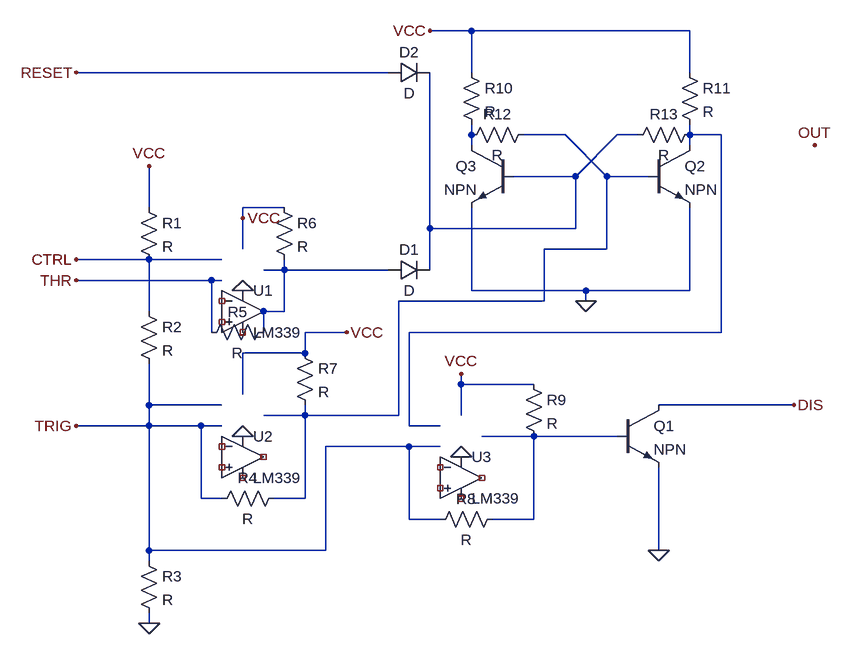
[diagram p0: schematic 555.asc]
555.asc, the LTspice schematic file:
Version 4
SHEET 1 1228 708
WIRE 624 -224 560 -224
WIRE 960 -224 624 -224
WIRE 496 -160 16 -160
WIRE 624 -160 624 -224
WIRE 960 -160 960 -224
WIRE 624 -64 624 -80
WIRE 768 -64 704 -64
WIRE 880 -64 848 -64
WIRE 960 -64 960 -80
WIRE 1008 -64 960 -64
WIRE 624 -48 624 -64
WIRE 960 -48 960 -64
WIRE 784 0 848 -64
WIRE 784 0 688 0
WIRE 832 0 768 -64
WIRE 896 0 832 0
WIRE 128 48 128 -16
WIRE 336 48 272 48
WIRE 272 64 272 48
WIRE 560 80 560 -160
WIRE 784 80 784 0
WIRE 784 80 560 80
WIRE 272 112 272 64
WIRE 832 112 832 0
WIRE 832 112 736 112
WIRE 128 128 16 128
WIRE 240 128 128 128
WIRE 336 144 336 128
WIRE 336 144 304 144
WIRE 496 144 336 144
WIRE 560 144 560 80
WIRE 224 160 16 160
WIRE 240 160 224 160
WIRE 624 176 624 48
WIRE 800 176 624 176
WIRE 960 176 960 48
WIRE 960 176 800 176
WIRE 736 192 736 112
WIRE 736 192 512 192
WIRE 800 192 800 176
WIRE 128 208 128 128
WIRE 336 208 336 144
WIRE 336 208 304 208
WIRE 224 240 224 160
WIRE 304 240 304 208
WIRE 432 240 368 240
WIRE 1008 240 1008 -64
WIRE 1008 240 528 240
WIRE 368 272 368 240
WIRE 368 272 272 272
WIRE 608 320 608 304
WIRE 720 320 608 320
WIRE 272 336 272 272
WIRE 128 352 128 288
WIRE 240 352 128 352
WIRE 1120 352 912 352
WIRE 368 368 368 352
WIRE 368 368 304 368
WIRE 512 368 512 192
WIRE 512 368 368 368
WIRE 608 368 608 320
WIRE 128 384 128 352
WIRE 128 384 16 384
WIRE 208 384 128 384
WIRE 240 384 208 384
WIRE 528 384 528 240
WIRE 576 384 528 384
WIRE 720 400 640 400
WIRE 848 400 720 400
WIRE 528 416 400 416
WIRE 576 416 528 416
WIRE 208 496 208 384
WIRE 240 496 208 496
WIRE 368 496 368 368
WIRE 368 496 320 496
WIRE 528 528 528 416
WIRE 576 528 528 528
WIRE 720 528 720 400
WIRE 720 528 656 528
WIRE 128 576 128 384
WIRE 400 576 400 416
WIRE 400 576 128 576
WIRE 912 576 912 448
WIRE 128 592 128 576
WIRE 128 688 128 672
FLAG 272 176 0
FLAG 272 400 0
FLAG 272 64 VCC
FLAG 432 240 VCC
FLAG 16 160 THR
FLAG 16 128 CTRL
FLAG 16 384 TRIG
FLAG 128 688 0
FLAG 128 -16 VCC
FLAG 16 -160 RESET
FLAG 608 432 0
FLAG 608 304 VCC
FLAG 912 576 0
FLAG 1120 352 DIS
FLAG 1152 -48 OUT
FLAG 800 192 0
FLAG 560 -224 VCC
SYMBOL res 112 32 R0
SYMATTR InstName R1
SYMBOL res 112 192 R0
SYMATTR InstName R2
SYMBOL res 112 576 R0
SYMATTR InstName R3
SYMBOL Comparators\\LM339 272 144 R0
SYMATTR InstName U1
SYMBOL Comparators\\LM339 272 368 R0
SYMATTR InstName U2
SYMBOL res 336 480 R90
WINDOW 0 0 56 VBottom 2
WINDOW 3 32 56 VTop 2
SYMATTR InstName R4
SYMBOL res 320 224 R90
WINDOW 0 0 56 VBottom 2
WINDOW 3 32 56 VTop 2
SYMATTR InstName R5
SYMBOL res 320 32 R0
SYMATTR InstName R6
SYMBOL res 352 256 R0
SYMATTR InstName R7
SYMBOL diode 496 160 R270
WINDOW 0 32 32 VTop 2
WINDOW 3 0 32 VBottom 2
SYMATTR InstName D1
SYMBOL diode 496 -144 R270
WINDOW 0 32 32 VTop 2
WINDOW 3 0 32 VBottom 2
SYMATTR InstName D2
SYMBOL Comparators\\LM339 608 400 R0
SYMATTR InstName U3
SYMBOL res 672 512 R90
WINDOW 0 0 56 VBottom 2
WINDOW 3 32 56 VTop 2
SYMATTR InstName R8
SYMBOL res 704 304 R0
SYMATTR InstName R9
SYMBOL npn 848 352 R0
SYMATTR InstName Q1
SYMBOL npn 896 -48 R0
SYMATTR InstName Q2
SYMBOL npn 688 -48 M0
SYMATTR InstName Q3
SYMBOL res 608 -176 R0
SYMATTR InstName R10
SYMBOL res 944 -176 R0
SYMATTR InstName R11
SYMBOL res 720 -80 R90
WINDOW 0 0 56 VBottom 2
WINDOW 3 32 56 VTop 2
SYMATTR InstName R12
SYMBOL res 976 -80 R90
WINDOW 0 0 56 VBottom 2
WINDOW 3 32 56 VTop 2
SYMATTR InstName R13

The netlist it stands for:
* 555.asc
R1 VCC CTRL R
R2 CTRL TRIG R
R3 TRIG 0 R
XU1 NC_01 NC_02 0 NC_03 N005 LM339  ; pins In+ In- V+ V- OUT
XU2 NC_04 NC_05 0 NC_06 NC_07 LM339  ; pins In+ In- V+ V- OUT
R4 N002 TRIG R
R5 N005 THR R
R6 VCC N005 R
R7 VCC N002 R
D1 N005 N003 D
D2 RESET N003 D
XU3 NC_08 NC_09 0 NC_10 NC_11 LM339  ; pins In+ In- V+ V- OUT
R8 N006 TRIG R
R9 VCC N006 R
Q1 DIS N006 0 0 NPN
Q2 N004 N002 0 0 NPN
Q3 N001 N003 0 0 NPN
R10 VCC N001 R
R11 VCC N004 R
R12 N002 N001 R
R13 N004 N003 R
.model D D
.lib standard.dio
.model NPN NPN
.model PNP PNP
.lib standard.bjt
.lib LM339.sub
.backanno
.end